# EAGLE design ICE_tng (EAGLE 5.06)
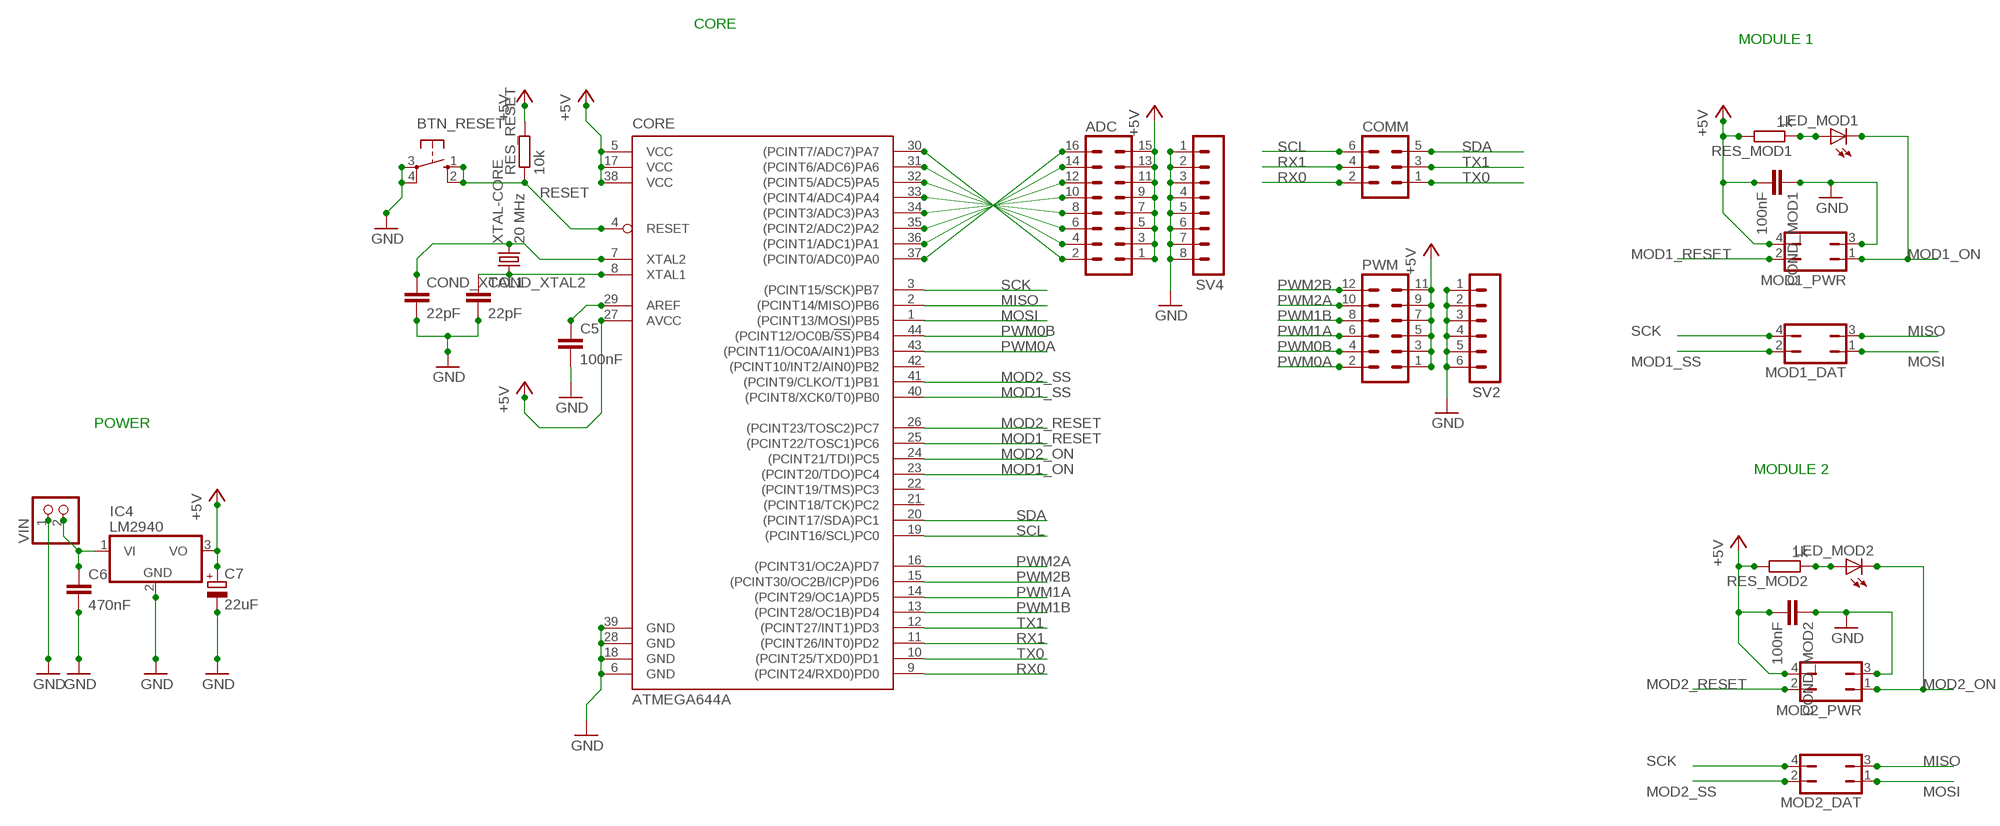
[diagram p0: schematic, sheet 1]

## Parts
ADC  MA08-2  [MA08-2]
BTN_RESET  10-XX  [B3F-10XX]
C5  100nF  C-EUC0805K  [C0805K]
C6  470nF  C-EUC0805K  [C0805K]
C7  22uF  CPOL-EUE5-4  [E5-4]
COMM  MA03-2  [MA03-2]
COND_MOD1  100nF  C-EUC0805K  [C0805K]
COND_MOD2  100nF  C-EUC0805K  [C0805K]
COND_XTAL1  22pF  C-EUC0805K  [C0805K]
COND_XTAL2  22pF  C-EUC0805K  [C0805K]
CORE  ATMEGA644A  [TQFP44]
IC4  LM2940  7815T  [TO220H]
LED_MOD1  LEDCHIPLED_0805  [CHIPLED_0805]
LED_MOD2  LEDCHIPLED_0805  [CHIPLED_0805]
MOD1_DAT  JP2Q  [JP2Q]
MOD1_PWR  JP2Q  [JP2Q]
MOD2_DAT  JP2Q  [JP2Q]
MOD2_PWR  JP2Q  [JP2Q]
PWM  MA06-2  [MA06-2]
RES_MOD1  1k  R-EU_R0805W  [R0805W]
RES_MOD2  1k  R-EU_R0805W  [R0805W]
RES_RESET  10k  R-EU_R0805W  [R0805W]
SV2  MA06-1  [MA06-1]
SV4  MA08-1  [MA08-1]
VIN  PINHD-1X2  [1X02]
XTAL-CORE  20 MHz  CRYSTALHC49S  [HC49/S]

## Nets
+5V: ADC.1 ADC.3 ADC.5 ADC.7 ADC.9 ADC.11 ADC.13 ADC.15 C7.+ COND_MOD1.2 COND_MOD2.2 CORE.5(VCC) CORE.17(VCC) CORE.27(AVCC) CORE.38(VCC) IC4.3(VO) MOD1_PWR.4 MOD2_PWR.4 PWM.1 PWM.3 PWM.5 PWM.7 PWM.9 PWM.11 RES_MOD1.2 RES_MOD2.2 RES_RESET.2
BAT+: C6.1 IC4.1(VI) VIN.2
GND: BTN_RESET.3(P) BTN_RESET.4(P1) C5.2 C6.2 C7.- COND_MOD1.1 COND_MOD2.1 COND_XTAL1.2 COND_XTAL2.2 CORE.6(GND) CORE.18(GND) CORE.28(GND) CORE.39(GND) IC4.2(GND) MOD1_PWR.3 MOD2_PWR.3 SV2.1 SV2.2 SV2.3 SV2.4 SV2.5 SV2.6 SV4.1 SV4.2 SV4.3 SV4.4 SV4.5 SV4.6 SV4.7 SV4.8 VIN.1
MISO: CORE.2((PCINT14/MISO)PB6) MOD1_DAT.3 MOD2_DAT.3
MOD1_ON: CORE.23((PCINT20/TDO)PC4) LED_MOD1.C MOD1_PWR.1
MOD1_RESET: CORE.25((PCINT22/TOSC1)PC6) MOD1_PWR.2
MOD1_SS: CORE.40((PCINT8/XCK0/T0)PB0) MOD1_DAT.2
MOD2_ON: CORE.24((PCINT21/TDI)PC5) LED_MOD2.C MOD2_PWR.1
MOD2_RESET: CORE.26((PCINT23/TOSC2)PC7) MOD2_PWR.2
MOD2_SS: CORE.41((PCINT9/CLKO/T1)PB1) MOD2_DAT.2
MOSI: CORE.1((PCINT13/MOSI)PB5) MOD1_DAT.1 MOD2_DAT.1
N$1: LED_MOD1.A RES_MOD1.1
N$2: COND_XTAL1.1 CORE.7(XTAL2) XTAL-CORE.2
N$3: COND_XTAL2.1 CORE.8(XTAL1) XTAL-CORE.1
N$4: C5.1 CORE.29(AREF)
N$5: ADC.16 CORE.37((PCINT0/ADC0)PA0)
N$6: ADC.14 CORE.36((PCINT1/ADC1)PA1)
N$7: ADC.12 CORE.35((PCINT2/ADC2)PA2)
N$8: ADC.10 CORE.34((PCINT3/ADC3)PA3)
N$9: ADC.8 CORE.33((PCINT4/ADC4)PA4)
N$10: ADC.6 CORE.32((PCINT5/ADC5)PA5)
N$11: ADC.4 CORE.31((PCINT6/ADC6)PA6)
N$12: ADC.2 CORE.30((PCINT7/ADC7)PA7)
N$13: LED_MOD2.A RES_MOD2.1
PWM0A: CORE.43((PCINT11/OC0A/AIN1)PB3) PWM.2
PWM0B: CORE.44((PCINT12/OC0B/!SS!)PB4) PWM.4
PWM1A: CORE.14((PCINT29/OC1A)PD5) PWM.6
PWM1B: CORE.13((PCINT28/OC1B)PD4) PWM.8
PWM2A: CORE.16((PCINT31/OC2A)PD7) PWM.10
PWM2B: CORE.15((PCINT30/OC2B/ICP)PD6) PWM.12
RESET: BTN_RESET.1(S) BTN_RESET.2(S1) CORE.4(RESET) RES_RESET.1
RX0: COMM.2 CORE.9((PCINT24/RXD0)PD0)
RX1: COMM.4 CORE.11((PCINT26/INT0)PD2)
SCK: CORE.3((PCINT15/SCK)PB7) MOD1_DAT.4 MOD2_DAT.4
SCL: COMM.6 CORE.19((PCINT16/SCL)PC0)
SDA: COMM.5 CORE.20((PCINT17/SDA)PC1)
TX0: COMM.1 CORE.10((PCINT25/TXD0)PD1)
TX1: COMM.3 CORE.12((PCINT27/INT1)PD3)
Unconnected: CORE.21((PCINT18/TCK)PC2) CORE.22((PCINT19/TMS)PC3) CORE.42((PCINT10/INT2/AIN0)PB2)

## Notes on the sheet
- CORE
- MODULE 1
- POWER
- MODULE 2

## Library data of the parts
ADC = con-lstb:MA08-2: PIN HEADER
BTN_RESET = switch-omron:10-XX: OMRON SWITCH
C5 C6 COND_MOD1 COND_MOD2 COND_XTAL1 COND_XTAL2 = rcl:C-EU: CAPACITOR, European symbol
C7 = rcl:CPOL-EU: POLARIZED CAPACITOR, European symbol
COMM = con-lstb:MA03-2: PIN HEADER
CORE = atmel:ATMEGA644: 8-bit Microcontroller with 64K Bytes In-System Programmable Flash Source: http://www.atmel.com/dyn/resources/prod_documents/doc2593.pdf
IC4 = linear:78*: Positive VOLTAGE REGULATOR Source: http://cache.national.com/ds/LM/LM78L05.pdf http://www.fairchildsemi.com/ds/LM/LM7805.pdf
LED_MOD1 LED_MOD2 = led:LED: LED OSRAM: - CHIPLED LG R971, LG N971, LY N971, LG Q971, LY Q971, LO R971, LY R971 LH N974, LH R974 LS Q976, LO Q976, LY Q976 LO Q996 - Hyper CHIPLED LW Q18S LB Q993, LB Q99A, LB R99A - SideLED LS A670, LO A670, LY A670, LG A670, LP A670 LB A673, LV A673, LT A673, LW A673 LH A674 LY A675 LS A676, LA A676, LO A676, LY A676, LW A676 LS A679, LY A679, LG A679 - Hyper Micro SIDELED® LS Y876, LA Y876, LO Y876, LY Y876 LT Y87S - SmartLED LW L88C, LW L88S LB L89C, LB L89S, LG L890 LS L89K, LO L89K, LY L89K LS L896, LA L896, LO L896, LY L896 - TOPLED LS T670, LO T670, LY T670, LG T670, LP T670 LSG T670, LSP T670, LSY T670, LOP T670, LYG T670 LG T671, LOG T671, LSG T671 LB T673, LV T673, LT T673, LW T673 LH T674 LS T676, LA T676, LO T676, LY T676, LB T676, LH T676, LSB T676, LW T676 LB T67C, LV T67C, LT T67C, LS T67K, LO T67K, LY T67K, LW E67C LS E67B, LA E67B, LO E67B, LY E67B, LB E67C, LV E67C, LT E67C LW T67C LS T679, LY T679, LG T679 LS T770, LO T770, LY T770, LG T770, LP T770 LB T773, LV T773, LT T773, LW T773 LH T774 LS E675, LA E675, LY E675, LS T675 LS T776, LA T776, LO T776, LY T776, LB T776 LHGB T686 LT T68C, LB T68C - Hyper Mini TOPLED® LB M676 - Mini TOPLED Santana® LG M470 LS M47K, LO M47K, LY M47K Source: http://www.osram.convergy.de LUXEON: - LUMILED® LXK2-PW12-R00, LXK2-PW12-S00, LXK2-PW14-U00, LXK2-PW14-V00 LXK2-PM12-R00, LXK2-PM12-S00, LXK2-PM14-U00 LXK2-PE12-Q00, LXK2-PE12-R00, LXK2-PE12-S00, LXK2-PE14-T00, LXK2-PE14-U00 LXK2-PB12-K00, LXK2-PB12-L00, LXK2-PB12-M00, LXK2-PB14-N00, LXK2-PB14-P00, LXK2-PB14-Q00 LXK2-PR12-L00, LXK2-PR12-M00, LXK2-PR14-Q00, LXK2-PR14-R00 LXK2-PD12-Q00, LXK2-PD12-R00, LXK2-PD12-S00 LXK2-PH12-R00, LXK2-PH12-S00 LXK2-PL12-P00, LXK2-PL12-Q00, LXK2-PL12-R00 Source: www.luxeon.com KINGBRIGHT: KA-3528ASYC Source: www.kingbright.com
MOD1_DAT MOD1_PWR MOD2_DAT MOD2_PWR = jumper:JP2Q: JUMPER
PWM = con-lstb:MA06-2: PIN HEADER
RES_MOD1 RES_MOD2 RES_RESET = rcl:R-EU_: RESISTOR, European symbol
SV2 = con-lstb:MA06-1: PIN HEADER
SV4 = con-lstb:MA08-1: PIN HEADER
VIN = pinhead:PINHD-1X2: PIN HEADER
XTAL-CORE = crystal:CRYSTAL: CRYSTAL

## Board
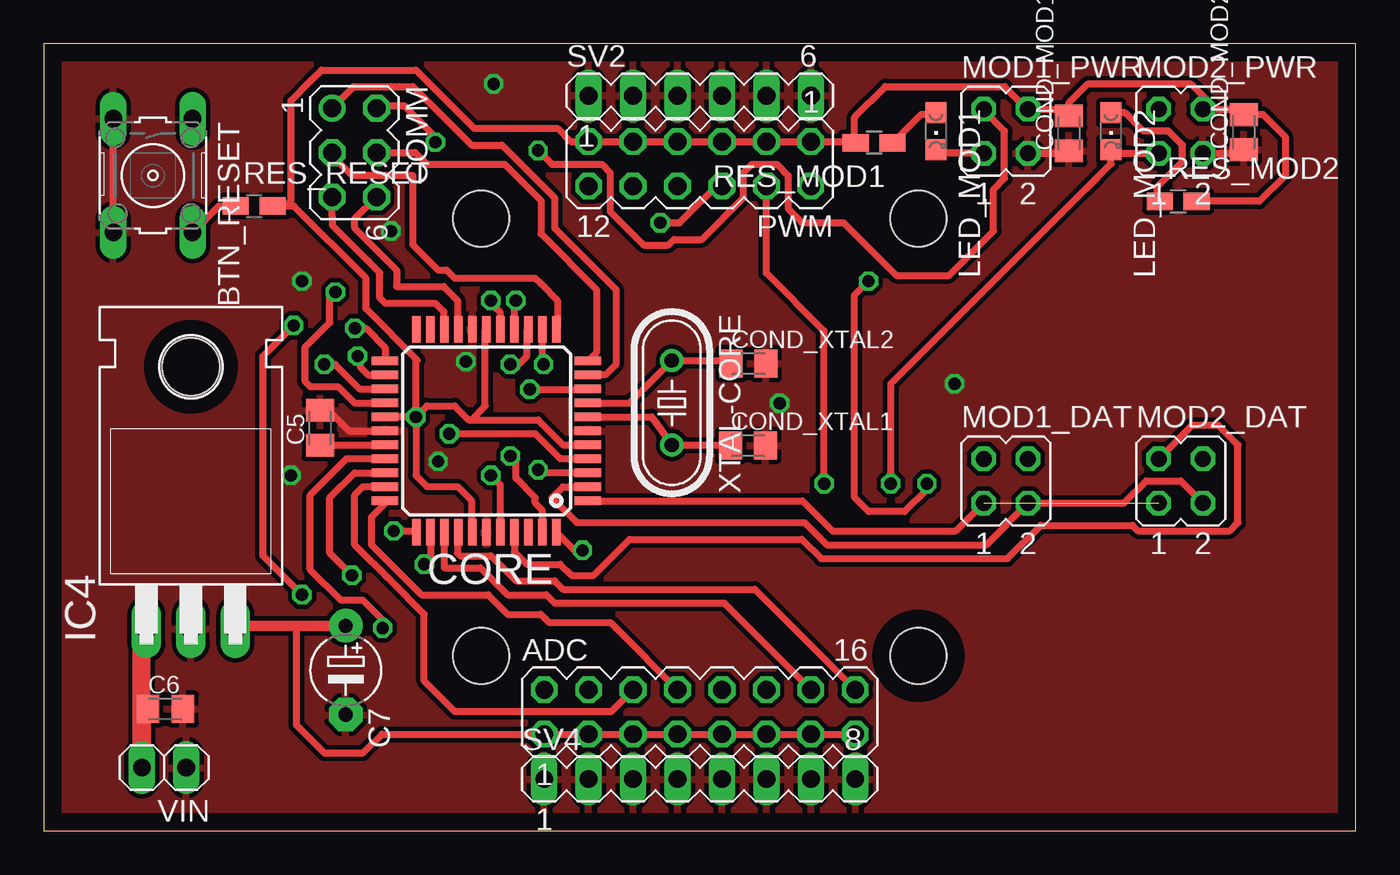
[diagram p1: board, top side]
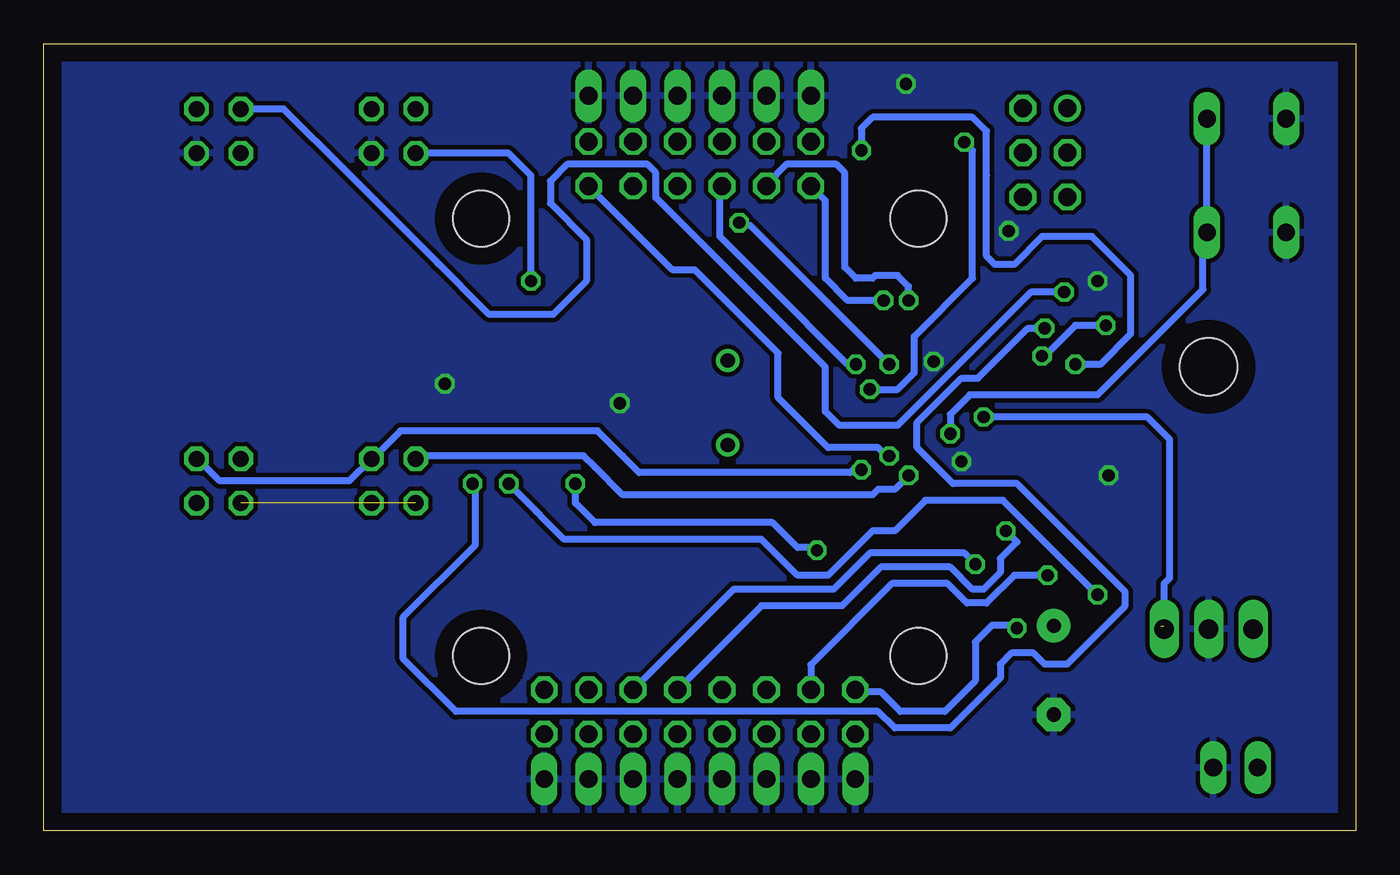
[diagram p2: board, bottom side, seen from below]

Size 75 x 45 mm. Coordinates in mm from the lower left corner, seen from the top.
Outline: 0,0 75,0 75,45 0,45 0,0
Copper layers (1*16): Top 0.035mm / dielectric 1.5mm / Bottom 0.035mm
Design rules "olimex-10mils": minimum track width 10mil, minimum drill 24mil, track to track 10mil, track to pad 10mil, pad to pad 10mil, via to via 10mil, smd to smd 10mil, copper to edge 40mil, drill to drill 10mil, minimum pad ring 10mil, minimum via ring 8mil, stop-mask expansion 0mil, vias tented up to drill 0mil, thermal gap 10mil
Holes 3.2 mm at 50,10 25,10 50,35 25,35

### Footprints (pad centres in the part's own frame; a part is rotated, then mirrored left to right if it is on the bottom)
MA08-2 = drill 1.016 octagon: 1 -8.89,-1.27; 2 -8.89,1.27; 3 -6.35,-1.27; 4 -6.35,1.27; 5 -3.81,-1.27; 6 -3.81,1.27; 7 -1.27,-1.27; 8 -1.27,1.27; 9 1.27,-1.27; 10 1.27,1.27; 11 3.81,-1.27; 12 3.81,1.27; 13 6.35,-1.27; 14 6.35,1.27; 15 8.89,-1.27; 16 8.89,1.27
B3F-10XX = drill 1.016 long: 1 -3.251,2.261; 2 3.251,2.261; 3 -3.251,-2.261; 4 3.251,-2.261
C0805K = smd 1.3 x 1.6: 1 -1,0; 2 1,0
E5-4 = drill 0.813 pad 1.905 round: + -2.54,0 | drill 0.813 pad 1.905 octagon: - 2.54,0
MA03-2 = drill 1.016 round: 1 -2.54,-1.27 | drill 1.016 octagon: 2 -2.54,1.27; 3 0,-1.27; 4 0,1.27; 5 2.54,-1.27; 6 2.54,1.27
TQFP44 = smd 1.5 x 0.5: 1 -5.8,4; 2 -5.8,3.2; 3 -5.8,2.4; 4 -5.8,1.6; 5 -5.8,0.8; 6 -5.8,0; 7 -5.8,-0.8; 8 -5.8,-1.6; 9 -5.8,-2.4; 10 -5.8,-3.2; 11 -5.8,-4; 23 5.8,-4; 24 5.8,-3.2; 25 5.8,-2.4; 26 5.8,-1.6; 27 5.8,-0.8; 28 5.8,0; 29 5.8,0.8; 30 5.8,1.6; 31 5.8,2.4; 32 5.8,3.2; 33 5.8,4 | smd 0.5 x 1.5: 12 -4,-5.8; 13 -3.2,-5.8; 14 -2.4,-5.8; 15 -1.6,-5.8; 16 -0.8,-5.8; 17 0,-5.8; 18 0.8,-5.8; 19 1.6,-5.8; 20 2.4,-5.8; 21 3.2,-5.8; 22 4,-5.8; 34 4,5.8; 35 3.2,5.8; 36 2.4,5.8; 37 1.6,5.8; 38 0.8,5.8; 39 0,5.8; 40 -0.8,5.8; 41 -1.6,5.8; 42 -2.4,5.8; 43 -3.2,5.8; 44 -4,5.8
TO220H = drill 1.118 long: 1 -2.54,-10.16; 2 0,-10.16; 3 2.54,-10.16 | hole 3.302: 0,4.826
CHIPLED_0805 = smd 1.2 x 1.2: A 0,-1.05; C 0,1.05
JP2Q = drill 0.914 octagon: 1 -1.27,-1.27; 2 -1.27,1.27; 3 1.27,-1.27; 4 1.27,1.27
MA06-2 = drill 1.016 octagon: 1 -6.35,-1.27; 2 -6.35,1.27; 3 -3.81,-1.27; 4 -3.81,1.27; 5 -1.27,-1.27; 6 -1.27,1.27; 7 1.27,-1.27; 8 1.27,1.27; 9 3.81,-1.27; 10 3.81,1.27; 11 6.35,-1.27; 12 6.35,1.27
R0805W = smd 1.5 x 1: 1 -1.052,0; 2 1.052,0
MA06-1 = drill 1.016 long: 1 -6.35,0; 2 -3.81,0; 3 -1.27,0; 4 1.27,0; 5 3.81,0; 6 6.35,0
MA08-1 = drill 1.016 long: 1 -8.89,0; 2 -6.35,0; 3 -3.81,0; 4 -1.27,0; 5 1.27,0; 6 3.81,0; 7 6.35,0; 8 8.89,0
1X02 = drill 1.016 long: 1 -1.27,0; 2 1.27,0
HC49/S = drill 0.813 round: 1 -2.413,0; 2 2.413,0

### Placement (x,y rotation side)
ADC  37.5,6.79 0 top
BTN_RESET  6.24,37.46 270 top
C5  15.79,23.04 90 top
C6  6.95,6.96 0 top
C7  17.27,9.18 270 top
COMM  17.76,38.77 270 top
COND_MOD1  58.61,39.87 90 top
COND_MOD2  68.59,39.95 90 top
COND_XTAL1  40.25,22.02 0 top
COND_XTAL2  40.28,26.71 0 top
CORE  25.31,22.87 180 top
IC4  8.41,21.7 0 top
LED_MOD1  51,40 180 top
LED_MOD2  61,40 180 top
MOD1_DAT  55,20 0 top
MOD1_PWR  55,40 0 top
MOD2_DAT  65,20 0 top
MOD2_PWR  65,40 0 top
PWM  37.5,38.13 180 top
RES_MOD1  47.47,39.34 180 top
RES_MOD2  64.85,35.99 0 top
RES_RESET  12.03,35.72 0 top
SV2  37.5,42.02 0 top
SV4  37.5,2.95 0 top
VIN  6.88,3.61 180 top
XTAL-CORE  35.9,24.47 270 top

### Tracks (layer width: path | path; a pad name or v marks a point on that pad's centre or on a via)
+5V  (via drill 0.7)  (1 unrouted)
  Top 0.406: 23.18,41.59 | ADC.15 ADC.13 ADC.11 ADC.9 ADC.7 ADC.5 ADC.3 ADC.1 19.34,5.52 18.26,4.45 16.03,4.45 14.45,6.03 14.45,11.56 14.61,11.72 | 21.27,23.67 CORE.27 | CORE.17 25.24,28.61 25.24,24.29 24.45,23.5 | CORE.5 29.68,22.07 28.26,23.5 24.45,23.5 | 13.81,35.72 14.29,35.72 18.41,31.59 18.41,29.84 21.35,26.91 21.27,26.83 21.27,23.67 | 13.81,35.72 RES_RESET.2 | CORE.38 24.45,17.13 24.45,18.89 23.65,19.68 21.91,19.68 21.27,20.32 v21.27,23.65 | C7.+ 17.3,11.68 | v21.27,23.65 21.27,23.67 | 11.13,11.72 IC4.3 | 10.95,11.75 10.98,11.72 | RES_MOD2.2 69.48,35.99 70.96,37.47 70.96,39.69 69.69,40.96 68.6,40.96 COND_MOD2.2 68.27,41.27 MOD2_PWR.4 66.36,41.36 66.36,41.91 65.56,42.7 59.69,42.7 58.61,41.62 COND_MOD1.2 58.21,41.27 MOD1_PWR.4 56.2,41.27 54.93,42.55 48.1,42.55 46.35,40.8 46.35,39.4 RES_MOD1.2 46.35,39.41 PWM.1 PWM.3 PWM.5 PWM.7 PWM.9 PWM.11 30.13,39.41 29.37,40.16 24.61,40.16 23.18,41.59 | 15.24,42.86 14.13,41.75 14.13,36.04 13.81,35.72 | 15.24,42.86 15.56,43.18 | 24.45,23.5 24.29,23.5 23.5,24.29 21.91,24.29 v21.27,23.65 | 23.18,41.59 21.27,43.5 15.88,43.5 15.24,42.86
  Top 0.61: 11.13,11.72 14.61,11.72 C7.+
  Bottom 0.406: C7.+ 17.08,11.54 | v21.27,23.65 11.91,23.65 10.64,22.38 10.64,14.45 10.95,14.13 IC4.3
BAT+
  Top 0.406: 5.61,11.28 IC4.1 | C6.1 5.95,3.95 VIN.2
  Top 1.016: VIN.2 5.61,11.28
GND  (via drill 0.7)
  Top 0.406: BTN_RESET.4 BTN_RESET.3 | MOD2_PWR.3 68.38,38.73 COND_MOD2.1 | MOD1_PWR.3 58.47,38.73 COND_MOD1.1 | C5.2 16.29,24.04 17.45,22.87 CORE.28
  Bottom 0.406: MOD1_PWR.3 56.2,38.73
  other vias: 42.07,24.45 52.07,25.56 22.54,21.11 25.72,42.7 19.84,34.29 14.76,31.43 24.13,26.83 14.13,20.32
  pour Bottom: 74.93,0 74.93,44.93 75.09,45.09 0.32,45.09 0.16,44.93 0.16,0 0,-0.16
  pour Top: 0,0.16 0,44.93 0.16,45.09 74.93,45.09 75.09,44.93 75.09,-0.16
MISO
  Top 0.406: CORE.2 29.67,19.67 29.05,19.05 29.21,19.05 29.21,18.89 30.48,17.62 43.5,17.62 44.77,16.35 53.89,16.35 MOD1_DAT.3 61.75,18.73 63.02,20 65,20 MOD2_DAT.3 66.36,18.64
MOD1_ON  (via drill 0.7)
  Top 0.406: MOD1_PWR.1 51.22,38.73 LED_MOD1.C | v50.48,19.84 50.48,19.53 49.21,18.26 47.15,18.26 46.35,19.05 46.35,30.64 v47.15,31.43 | CORE.23 19.51,27.64 18.41,28.73 v17.78,28.73
  Bottom 0.406: v17.78,28.73 18.73,28.73 21.59,25.88 22.54,25.88 25.08,23.34 25.08,21.91 23.02,19.84 19.37,19.84 13.18,13.65 13.18,12.86 16.51,9.53 17.78,9.53 18.41,10.16 19.68,10.16 20.32,9.53 20.32,8.73 23.18,5.87 26.35,5.87 27.3,6.83 51.44,6.83 54.45,9.84 54.45,12.22 50.32,16.35 50.32,19.68 v50.48,19.84 | v47.15,31.43 47.15,37.47 48.42,38.73 MOD1_PWR.1
MOD1_RESET  (via drill 0.7)
  Top 0.406: MOD1_PWR.2 53.73,41.2 54.93,40.01 54.93,37.31 54.29,36.67 54.29,34.29 51.75,31.75 48.74,31.75 45.72,34.77 43.34,34.77 42.55,35.56 | CORE.25 18.07,25.27 16.67,26.67 v16.03,26.67 | 42.55,35.56 42.55,37.47 41.91,38.1 40.48,38.1 40.01,37.62 40.01,36.2 37.62,33.81 36.04,33.81 35.72,33.5 34.29,33.5 32.38,35.4 32.38,37.62 31.91,38.1 29.05,38.1 v28.26,38.89 28.1,38.89 | 42.55,35.56
  Bottom 0.406: v28.26,38.89 28.26,40.16 27.62,40.8 21.91,40.8 21.11,40.01 21.11,37.47 | 21.11,37.47 21.11,32.86 20.64,32.38 19.53,32.38 17.94,33.97 15.08,33.97 12.86,31.75 12.86,28.42 14.61,26.67 v16.03,26.67 | 21.11,37.47
MOD1_SS  (via drill 0.7)
  Top 0.406: CORE.40 26.11,19.77 v25.56,20.32
  Bottom 0.406: MOD1_DAT.2 53.57,21.43 44.13,21.43 43.5,20.8 41.91,19.21 27.62,19.21 27.3,19.53 26.35,19.53 v25.56,20.32
MOD2_ON  (via drill 0.7)
  Top 0.406: MOD2_PWR.1 61.22,38.73 LED_MOD2.C 61,38.14 | 61,38.14 59.53,36.67 | v48.42,19.84 48.42,25.56 61,38.14 | CORE.24 18.54,26.07 18.1,26.51 18.1,26.99 v17.94,27.15 | v14.76,13.49 12.54,15.72 12.54,27.15 v14.29,28.89
  Bottom 0.406: 47.94,19.37 46.83,18.26 | 47.94,19.37 v48.42,19.84 | v14.29,28.89 16.03,28.89 17.78,27.15 v17.94,27.15 | 47.94,19.37 45.24,16.67 33.97,16.67 31.91,14.61 30.16,14.61 27.62,17.14 26.35,17.14 24.61,18.89 20.16,18.89 v14.76,13.49
MOD2_RESET  (via drill 0.7)
  Top 0.406: v16.67,30.8 16.35,30.48 16.35,29.05 14.92,27.62 14.92,25.72 15.24,25.4 16.83,25.4 17.78,24.45 19.48,24.45 CORE.26
  Bottom 0.406: MOD2_PWR.2 61.27,41.27 57.71,37.7 | 57.71,37.7 56.99,36.99 | 52.7,32.7 52.39,32.38 | 52.7,32.7 57.71,37.7 | 52.7,32.7 49.53,29.53 45.88,29.53 43.97,31.43 43.97,33.81 46.04,35.88 46.04,37.15 45.09,38.1 40.48,38.1 40.01,37.62 40.01,36.2 30.32,26.51 30.32,23.97 29.53,23.18 26.19,23.18 18.57,30.8 v16.67,30.8
MOD2_SS
  Top 0.406: MOD2_DAT.2 65.64,23.18 67.15,23.18 68.26,22.07 68.26,17.62 67.79,17.14 62.55,17.14 62.23,17.46 56.99,17.46 55.09,15.56 44.45,15.56 43.34,16.67 33.5,16.67 31.43,14.61 30.16,14.61 29.53,15.24 27.62,15.24 26.91,15.96 CORE.41
MOSI  (1 unrouted)
  Top 0.406: 53.73,18.66 MOD1_DAT.1 52.15,17.14 45.09,17.14 43.36,18.87 CORE.1
N$1
  Top 0.406: RES_MOD1.1 48.55,39.34 50.16,40.96 50.91,40.96 LED_MOD1.A
N$2
  Top 0.406: CORE.7 34.75,23.67 XTAL-CORE.2 39.21,22.06 COND_XTAL1.1
N$3
  Top 0.406: COND_XTAL2.1 39.1,26.89 XTAL-CORE.1 33.49,24.47 CORE.8
N$4
  Top 0.406: CORE.29 16.3,22.07 C5.1
N$5
  Top 0.406: CORE.37 23.65,17.02 23.65,15.88 23.81,15.72 25.56,15.72 26.99,14.29 29.21,14.29 29.69,13.81 40.64,13.81 40.8,13.65 ADC.16
N$6
  Top 0.406: ADC.14 38.9,13.02 29.21,13.02 28.73,13.49 26.51,13.49 26.35,13.65 24.97,15.04 22.91,15.04 CORE.36
N$7  (via drill 0.7)
  Top 0.406: v21.75,15.24 | CORE.35 22.11,15.6 v21.75,15.24
  Bottom 0.406: ADC.12 35.56,13.81 29.84,13.81 27.78,15.88 22.38,15.88 v21.75,15.24
N$8  (via drill 0.7)
  Top 0.406: 21.27,17.04 CORE.34 21.23,17.14 v20,17.14
  Bottom 0.406: ADC.10 33.98,12.86 29.37,12.86 27.15,15.08 23.18,15.08 21.91,13.81 21.27,13.81 20.32,14.76 20.32,15.56 19.37,16.51 v20,17.14
N$9
  Top 0.406: CORE.33 19.51,18.71 18.73,17.94 18.73,16.35 21.59,13.49 25.4,13.49 26.51,12.38 28.42,12.38 28.89,11.91 32.39,11.91 32.7,11.59 ADC.8
N$10
  Top 0.406: 19.84,14.29 21.75,12.38 21.75,8.57 23.5,6.83 32.45,6.83 ADC.6 | 19.84,14.29 19.53,14.61 | CORE.32 19.49,19.68 18.26,19.68 17.78,19.21 17.78,16.35 19.84,14.29
N$11  (via drill 0.7)
  Top 0.406: CORE.31 17.77,20.47 16.35,19.05 16.35,15.88 v17.62,14.61
  Bottom 0.406: ADC.4 31.15,9.49 26.51,14.13 23.34,14.13 22.23,13.02 21.11,13.02 19.53,14.61 v17.62,14.61
N$12  (via drill 0.7)
  Top 0.406: CORE.30 17.3,21.27 15.24,19.21 15.24,14.92 16.99,13.18 18.26,13.18 19.37,12.06 v19.37,11.59
  Bottom 0.406: ADC.2 28.48,7.94 27.15,7.94 26.04,6.83 23.5,6.83 21.75,8.57 21.75,10.79 20.8,11.75 19.53,11.75 v19.37,11.59
N$13
  Top 0.406: LED_MOD2.A 61.82,41.05 62.87,40.01 64.29,40.01 65.09,39.21 65.09,38.26 63.66,36.83 63.66,36.12 RES_MOD2.1
PWM0A  (via drill 0.7)
  Top 0.406: CORE.43 28.51,18.32 28.1,18.73 28.1,19.05 26.99,20.16 26.99,21.11 v26.67,21.43
  Bottom 0.406: PWM.2 39.05,32.07 37.78,32.07 33.02,27.3 33.02,24.77 30.16,21.91 27.3,21.91 26.83,21.43 v26.67,21.43
PWM0B  (via drill 0.7)
  Top 0.406: PWM.4 41.31,31.87 44.61,28.57 v44.61,19.84 | v30.8,16.03 30.34,16.03 CORE.44
  Bottom 0.406: v30.8,16.03 30.96,15.88 30.96,16.19 31.91,16.19 33.34,17.62 43.5,17.62 44.61,18.73 v44.61,19.84
PWM1A  (via drill 0.7)
  Top 0.406: PWM.6 38.77,37.18 36.35,34.77 v35.24,34.77 | v26.67,26.67 27.15,26.67 27.62,27.15 27.62,28.59 CORE.14
  Bottom 0.406: v26.67,26.67 30.88,30.88 | 30.88,30.88 31.27,31.27 | 30.88,30.88 34.61,34.61 35.08,34.61 v35.24,34.77
PWM1B  (via drill 0.7)
  Top 0.406: CORE.13 28.51,26.74 v28.57,26.67
  Bottom 0.406: v28.57,26.67 29.05,26.67 33.66,31.27 | 33.66,31.27 | 33.66,31.27 36.35,33.97 36.35,36.74 PWM.8
PWM2A  (via drill 0.7)
  Top 0.406: 25.72,30.32 v25.56,30.32 25.88,30 25.88,29.84 26.11,29.61 CORE.16
  Bottom 0.406: v25.56,30.32 25.56,31.11 26.19,31.75 27.46,31.75 27.62,31.59 28.57,31.59 29.21,32.23 29.21,37.62 29.69,38.1 32.54,38.1 33.69,36.95 PWM.10
PWM2B  (via drill 0.7)
  Top 0.406: CORE.15 26.91,30.24 v26.99,30.32
  Bottom 0.406: v26.99,30.32 29.05,30.32 30.32,31.59 30.32,36.04 PWM.12
RESET  (via drill 0.7)
  Top 0.406: 10.89,35.8 RES_RESET.1 10.01,35.72 BTN_RESET.2 | v23.18,22.7 28.1,22.7 29.53,21.27 CORE.4
  Bottom 0.406: v23.18,22.7 23.18,23.81 22.07,24.92 14.76,24.92 8.73,30.96 8.73,33.98 BTN_RESET.2 BTN_RESET.1
RX0  (via drill 0.7)
  Top 0.406: CORE.9 31.08,25.24 v27.78,25.24 | v22.38,39.37 22.38,39.69 20.64,41.43 19.15,41.43 COMM.2
  Bottom 0.406: 22.23,39.21 v22.38,39.37 21.91,38.89 21.91,31.59 25.24,28.26 25.24,26.19 26.19,25.24 v27.78,25.24
RX1
  Top 0.406: CORE.11 31.59,27.36 31.59,30.96 28.42,34.13 28.42,36.04 26.35,38.1 21.91,38.1 21.23,38.77 COMM.4
SCK  (via drill 0.7)
  Top 0.406: CORE.3 28.42,20.48 v28.26,20.64
  Bottom 0.406: MOD2_DAT.4 66.2,21.27 64.93,20 57.54,20 MOD1_DAT.4 56.27,21.2 | 56.27,21.2 56.27,21.19 | 56.27,21.2 54.61,22.86 43.34,22.86 41.91,21.43 40.96,20.48 28.89,20.48 28.73,20.64 v28.26,20.64
SCL
  Top 0.406: CORE.19 23.65,28.72 23.65,30.32 22.86,31.11 20.16,31.11 20.16,32.07 17.78,34.45 17.78,34.99 COMM.6
SDA
  Top 0.406: COMM.5 16.49,35.1 16.51,35.08 16.51,34.61 18.57,32.54 | CORE.20 22.86,28.72 22.86,29.69 22.38,30.16 19.53,30.16 19.21,30.48 19.21,31.91 18.57,32.54 | 18.57,32.54
TX0
  Top 0.406: CORE.10 32.1,26.07 32.7,26.67 32.7,30.96 29.21,34.45 29.21,36.2 26.19,39.21 24.45,39.21 21.11,42.55 19.84,42.55 | 19.84,42.55 17.72,42.55 COMM.1 | 19.84,42.55 20.32,42.55
TX1
  Top 0.406: COMM.3 16.49,38.6 17.62,37.47 21.11,37.47 21.11,33.5 22.54,32.07 23.02,32.07 23.5,31.59 28.1,31.59 28.42,31.27 | 28.42,31.27 29.37,30.32 29.37,28.73 CORE.12 | 28.42,31.27